# Altium project TINY24.PrjPcb
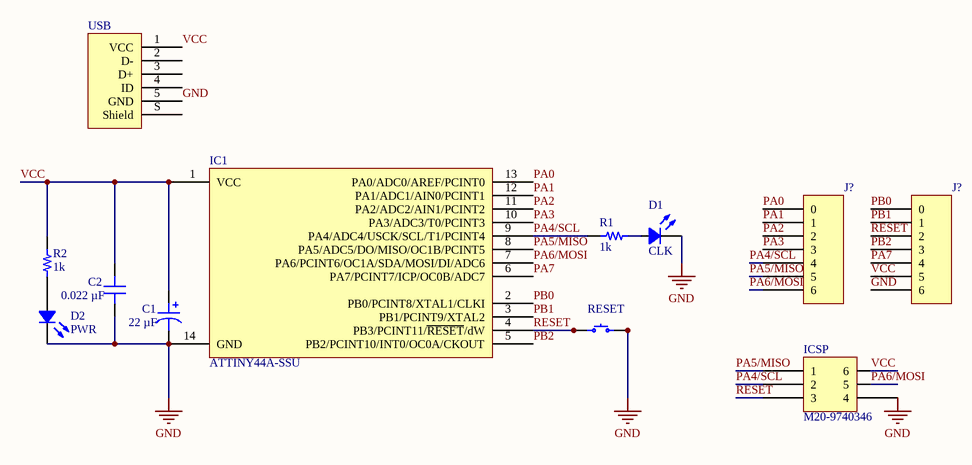
[diagram p0: TINY24.SchDoc]
1 sheet, 12 parts. Net scope: global (net labels, ports and power ports of the same name join across sheets).
Board file: TINY24_PCB.PcbDoc

## Sheet TINY24.SchDoc
size A4; SheetNumber: 1; SheetTotal: 1

### Parts
C1  22 µF  [CAP POL 1206_3216]
C2  0.022 µF  [CAP 0402_1005]
D1  CLK  [LED 0805_2012 GREEN]
D2  PWR  [LED 0805_2012 GREEN]
IC1  ATTINY44A-SSU  [ATMEL SO-14 14S1]
ICSP  M20-9740346  [HARWIN M20-9740345]
J1  7pin-2.54MaleHeader  [7Pin2.54Header]  (value not drawn)
J2  7pin-2.54MaleHeader  [7Pin2.54Header]  (value not drawn)
R1  1k  [RES 0402_1005]
R2  1k  [RES 0402_1005]
RESET  B3FS-1012P  [OMRON B3FS-1012P]  (value not drawn)
USB  10118193-0001LF  [FCI USB 10118193-0001LF]  (value not drawn)

### Nets
GND: C1.2 C2.1 D1.2 D2.2 IC1.14(GND) ICSP.4 J1.6 RESET.3 RESET.4 USB.5(GND)
PA0: IC1.13(PA0/ADC0/AREF/PCINT0) J2.0
PA1: IC1.12(PA1/ADC1/AIN0/PCINT1) J2.1
PA2: IC1.11(PA2/ADC2/AIN1/PCINT2) J2.2
PA3: IC1.10(PA3/ADC3/T0/PCINT3) J2.3
PA4/SCL: IC1.9(PA4/ADC4/USCK/SCL/T1/PCINT4) ICSP.2 J2.4 R1.1
PA5/MISO: IC1.8(PA5/ADC5/DO/MISO/OC1B/PCINT5) ICSP.1 J2.5
PA6/MOSI: IC1.7(PA6/PCINT6/OC1A/SDA/MOSI/DI/ADC6) ICSP.5 J2.6
PA7: IC1.6(PA7/PCINT7/ICP/OC0B/ADC7) J1.4
PB0: IC1.2(PB0/PCINT8/XTAL1/CLKI) J1.0
PB1: IC1.3(PB1/PCINT9/XTAL2) J1.1
PB2: IC1.5(PB2/PCINT10/INT0/OC0A/CKOUT) J1.3
RESET: IC1.4(PB3/PCINT11/~{RESET}/dW) ICSP.3 J1.2 RESET.1 RESET.2
VCC: C1.1 C2.2 IC1.1(VCC) ICSP.6 J1.5 R2.2 USB.1(VCC)
NetD1_1: D1.1 R1.2
NetD2_1: D2.1 R2.1

Not connected (* = marked no-connect by the designer): USB 2(D-) 3(D+) 4(ID) S(Shield)

### Notes on the sheet
- (in symbol 7pin-2.54MaleHeader) J?

### Library data of the parts
C1 = 293D105X9016A8T: manufacturer: Vishay Sprague; Manufacturer Size Code: A; Capacitance: 1 µF; ESR (Equivalent Series Resistance): 9.3Ohm @ 100kHz; Tolerance: ±10%; Type: Molded; Voltage - Rated: 16 V; Part Number: 293D105X9016A8T; Value: 22 µF; componentlink1description: Datasheet; componentlink1url: https://www.vishay.com/docs/40002/293d.pdf; componentlink2description: DigiKey Link; componentlink2url: https://www.digikey.com/en/products/detail/vishay-sprague/293D105X9016A8T/21707485; Device Package: 1206 (3216 Metric); Features: General Purpose; Height - Seated (Max): 0.071" (1.80mm); lastupdated: 03.06.2024 19:29:26; Lifecycle Status: Active; Minimum Order: 1; Mounting Type: Surface Mount; Operating Temperature: -55°C ~ 125°C; Package / Case: 1206 (3216 Metric); packaging: TapeAndReel; partid: 5870; price: 0.18; series: TANTAMOUNT™, 293D; Size / Dimension: 0.126" L x 0.063" W (3.20mm x 1.60mm); Supplier 1: DigiKey; Supplier Part Number 1: 718-293D105X9016A8TCT-ND
C2 = C0402C223K5RECAUTO: CAP CER 0402 22NF 50V X7R 10%; manufacturer: KEMET; Part Number: C0402C223K5RECAUTO; Capacitance: 0.022 µF; Applications: Automotive, ESD Protection; componentlink1description: Datasheet; componentlink1url: https://api.kemet.com/component-edge/download/datasheet/C0402C223K5RECAUTO.pdf; componentlink2description: DigiKey Link; componentlink2url: https://www.digikey.com/en/products/detail/kemet/C0402C223K5RECAUTO/8563694; Device Package: 0402 (1005 Metric); lastupdated: 09.02.2024 20:04:38; Lifecycle Status: Active; Minimum Order: 1; Mounting Type: Surface Mount, MLCC; Operating Temperature: -55°C ~ 125°C; Package / Case: 0402 (1005 Metric); packaging: TapeAndReel; partid: 1729; Part Status: Active; price: 0.01; Ratings: AEC-Q200; series: ESD SMD Auto X7R; Size / Dimension: 0.039" L x 0.020" W (1.00mm x 0.50mm); Supplier 1: DigiKey; Supplier Part Number 1: 399-17166-1-ND; Temperature Coefficient: X7R; Thickness (Max): 0.022" (0.55mm); Tolerance: ±10%; value: 0.022 µF; Voltage - Rated: 50V
D1 D2 = QTLP630C4TR: LED GREEN CLEAR 0805 SMD; Manufacturer: Everlight Electronics Co Ltd; Configuration: Standard; Current - Test: 20mA; Lens Color: Colorless; Lens Size: 1.40mm x 1.25mm; Lens Style: Rectangle with Flat Top; Millicandela Rating: 10mcd; Viewing Angle: 140°; Voltage - Forward (Vf) (Typ): 2.1V; Wavelength - Dominant: 570nm; Wavelength - Peak: 565nm; Part Number: QTLP630C4TR; Color: Green; ComponentLink1Description: Datasheet; ComponentLink1URL: //media.digikey.com/PDF/Data%20Sheets/Everlight%20PDFs/QTLP630-2.pdf; ComponentLink2Description: DigiKey Link; ComponentLink2URL: https://www.digikey.com/en/products/detail/everlight-electronics-co-ltd/QTLP630C4TR/2675902; Device Package: 0805 (2012 Metric); Height (Max): 1.20mm; LastUpdated: 03.06.2024 20:00:30; Lens Transparency: Clear; Lifecycle Status: Active; Minimum Order: 1; Mounting Type: Surface Mount; Package / Case: 0805 (2012 Metric); Packaging: TapeAndReel; PartId: 240; Part Status: Active; Price: 0.05; Series: -; Size / Dimension: 2.00mm L x 1.25mm W; Supplier 1: DigiKey; Supplier Part Number 1: 1080-1411-1-ND; Supplier Device Package: 0805; Value: Green
IC1 = ATTINY44A-SSU: IC MCU 8BIT 4KB FLASH 14SOIC; Manufacturer: Microchip Technology; Connectivity: USI; Core Processor: AVR; Core Size: 8-Bit; Data Converters: A/D 8x10b; EEPROM Size: 256 x 8; Number of I/O: 12; Oscillator Type: Internal; Peripherals: Brown-out Detect/Reset, POR, PWM, Temp Sensor, WDT; Program Memory Size: 4KB (2K x 16); Speed: 20MHz; Voltage - Supply (Vcc/Vdd): 1.8V ~ 5.5V; Part Number: ATTINY44A-SSU; ComponentLink1Description: Datasheet; ComponentLink1URL: http://www.microchip.com/mymicrochip/filehandler.aspx?ddocname=en590191; ComponentLink2Description: DigiKey Link; ComponentLink2URL: //digikey.com/product-detail/en/microchip-technology/ATTINY44A-SSU/ATTINY44A-SSU-ND/1914708; Device Package: 14-SOIC (0.154", 3.90mm Width); LastUpdated: 04.12.2019 4:12:07; Lifecycle Status: 0; Minimum Order: 1; Mounting Type: Surface Mount; Operating Temperature: -40°C ~ 85°C (TA); Package / Case: 14-SOIC (0.154", 3.90mm Width); Packaging: Tube; PartId: 95; Part Status: Active; Price: 0.72; Program Memory Type: FLASH; RAM Size: 256 x 8; Series: AVR® ATtiny; Supplier 1: DigiKey; Supplier Part Number 1: ATTINY44A-SSU-ND; Supplier Device Package: 14-SOIC
ICSP = M20-9740346: CONN HEADER R/A 6POS 2.54MM; Manufacturer: Harwin Inc.; Connector Type: Header, Cuttable; Current Rating (Amps): 3A per Contact; Material Flammability Rating: UL94 V-0; Number of Positions: 6; Number of Positions Loaded: All; Shrouding: Unshrouded; Style: Board to Board or Cable; Part Number: M20-9740346; ComponentLink1Description: Datasheet; ComponentLink1URL: https://cdn.harwin.com/pdfs/M20-974.pdf; ComponentLink2Description: DigiKey Link; ComponentLink2URL: http://digikey.com/product-detail/en/harwin-inc/M20-9740346/M20-9740346-ND/3920713; Contact Finish - Mating: Tin; Contact Finish - Post: Tin; Contact Material: Brass; Contact Shape: Square; Contact Type: Male Pin; Fastening Type: Push-Pull; Insulation Color: Black; Insulation Material: Polyamide (PA6T), Nylon 6T; LastUpdated: 21.09.2022 19:29:59; Lifecycle Status: Active; Minimum Order: 4000; Mounting Type: Through Hole, Right Angle; Number of Rows: 2; Operating Temperature: -40°C ~ 105°C; Packaging: Bulk; PartId: 156; Part Status: Active; Price: 0.10; Series: M20; Supplier 1: DigiKey; Supplier Part Number 1: M20-9740346-ND; Termination: Solder
J1 J2 = 7pin-2.54MaleHeader: 2.54 Male Header DuPont 7pin
R1 R2 = RCA04021K00FKEDHP: RES 1K OHM 1% 1/5W 0402; Manufacturer: Vishay Dale; Power (Watts): 0.2W, 1/5W; Resistance: 1 kOhms; Temperature Coefficient: ±100ppm/°C; Part Number: RCA04021K00FKEDHP; Value: 1k; ComponentLink1Description: Datasheet; ComponentLink1URL: http://www.vishay.com/docs/20067/rcahp.pdf; ComponentLink2Description: DigiKey Link; ComponentLink2URL: https://www.digikey.com/en/products/detail/vishay-dale/RCA04021K00FKEDHP/6561237; Composition: Thick Film; Device Package: 0402 (1005 Metric); Features: Anti-Sulfur, Automotive AEC-Q200, Pulse Withstanding; Height - Seated (Max): 0.016" (0.40mm); LastUpdated: 09.02.2024 20:30:21; Lifecycle Status: Active; Minimum Order: 1; Number of Terminations: 2; Operating Temperature: -55°C ~ 155°C; Package / Case: 0402 (1005 Metric); Packaging: TapeAndReel; PartId: 3119; Part Status: Active; Price: 0.02; Ratings: AEC-Q200; Series: RCA-HP; Size / Dimension: 0.039" L x 0.020" W (1.00mm x 0.50mm); Supplier 1: DigiKey; Supplier Part Number 1: 541-3240-1-ND; Supplier Device Package: 0402; Tolerance: ±1%
RESET = B3FS-1012P: SWITCH TACTILE SPST-NO 0.05A 24V; Manufacturer: Omron Electronics Inc-EMC Div; Actuator Height off PCB, Vertical: 4.30mm; Actuator Orientation: Top Actuated; Actuator Type: Standard; Contact Rating @ Voltage: 0.05A @ 24VDC; Illumination: Non-Illuminated; Operating Force: 150gf; Outline: 6.30mm x 6.00mm; Switch Function: Off-Mom; Part Number: B3FS-1012P; Circuit: SPST-NO; ComponentLink1Description: Datasheet; ComponentLink1URL: https://omronfs.omron.com/en_US/ecb/products/pdf/en-b3fs.pdf; ComponentLink2Description: DigiKey Link; ComponentLink2URL: http://digikey.com/product-detail/en/omron-electronics-inc-emc-div/B3FS-1012P/SW1237CT-ND/2747253; LastUpdated: 30.03.2020 15:12:46; Lifecycle Status: Active; Minimum Order: 1; Mounting Type: Surface Mount; Operating Temperature: -25°C ~ 70°C; Packaging: TapeAndReel; Part Status: Active; Price: 0.35; Series: B3FS; Supplier 1: DigiKey; Supplier Part Number 1: SW1237CT-ND; Termination Style: Gull Wing
USB = 10118193-0001LF: CONN RCPT USB2.0 MICRO B SMD R/A; Manufacturer: Amphenol ICC (FCI); Connector Type: USB - micro B; Current Rating (Amps): 1.8A per Contact; Gender: Receptacle; Mating Cycles: 10000; Number of Contacts: 5; Number of Ports: 1; Shielding: Shielded; Voltage - Rated: 100VAC; Part Number: 10118193-0001LF; ComponentLink1Description: Datasheet; ComponentLink1URL: https://cdn.amphenol-icc.com/media/wysiwyg/files/documentation/datasheet/inputoutput/io_usb_micro.pdf; ComponentLink2Description: DigiKey Link; ComponentLink2URL: //digikey.com/product-detail/en/amphenol-icc-fci/10118193-0001LF/609-4616-2-ND/2785388; Features: Solder Retention; LastUpdated: 09.12.2019 20:51:28; Lifecycle Status: 0; Minimum Order: 1; Mounting Feature: Horizontal; Mounting Type: Surface Mount, Right Angle; Through Hole; Operating Temperature: -30°C ~ 80°C; Packaging: TapeAndReel; Part Status: Active; Price: 0.21; Series: -; Specifications: USB 2.0; Supplier 1: DigiKey; Supplier Part Number 1: 609-4616-2-ND; Termination: Solder